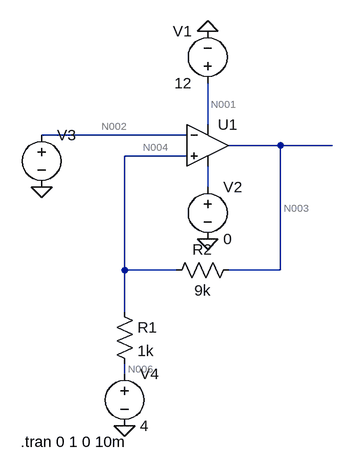
[diagram p0: schematic schmidt trigger.asc]
schmidt trigger.asc, the LTspice schematic file:
Version 4.1
SHEET 1 880 712
WIRE 240 208 240 144
WIRE 208 224 -16 224
WIRE 352 240 272 240
WIRE 432 240 352 240
WIRE 208 256 112 256
WIRE 240 304 240 272
WIRE 112 432 112 256
WIRE 192 432 112 432
WIRE 352 432 352 240
WIRE 352 432 272 432
WIRE 112 496 112 432
WIRE 112 592 112 576
FLAG 240 384 0
FLAG -16 304 0
FLAG 240 64 0
FLAG 112 672 0
SYMBOL OpAmps\\UniversalOpAmp2 240 240 R0
SYMATTR InstName U1
SYMBOL voltage 240 160 R180
WINDOW 0 24 96 Left 2
WINDOW 3 24 16 Left 2
WINDOW 123 0 0 Left 0
WINDOW 39 0 0 Left 0
SYMATTR InstName V1
SYMATTR Value 12
SYMBOL voltage -16 208 R0
WINDOW 3 24 96 Invisible 2
WINDOW 123 0 0 Left 0
WINDOW 39 0 0 Left 0
SYMATTR Value SINE(3.5 1.5 10)
SYMATTR InstName V3
SYMBOL voltage 240 288 R0
WINDOW 123 0 0 Left 0
WINDOW 39 0 0 Left 0
SYMATTR InstName V2
SYMATTR Value 0
SYMBOL res 288 416 R90
WINDOW 0 0 56 VBottom 2
WINDOW 3 32 56 VTop 2
SYMATTR InstName R2
SYMATTR Value 9k
SYMBOL res 96 480 R0
SYMATTR InstName R1
SYMATTR Value 1k
SYMBOL voltage 112 576 R0
WINDOW 123 0 0 Left 0
WINDOW 39 0 0 Left 0
SYMATTR InstName V4
SYMATTR Value 4
TEXT -48 696 Left 2 !.tran 0 1 0 10m

The netlist it stands for:
* schmidt trigger.asc
X§U1 N004 N002 N001 N005 N003 level2 Avol=1Meg GBW=10Meg Slew=10Meg Ilimit=25m Rail=0 Vos=0 En=0 Enk=0 In=0 Ink=0 Rin=500Meg  ; pins In+ In- V+ V- OUT
V1 N001 0 12
V3 N002 0 SINE(3.5 1.5 10)
V2 N005 0 0
R2 N003 N004 9k
R1 N004 N006 1k
V4 N006 0 4
.tran 0 1 0 10m
.lib UniversalOpAmp2.lib
.backanno
.end

* Results of the author's LTspice run, read from the files saved beside the schematic
* Operating Point, zero values left out:
*   V(n001) = 12 V
*   V(n002) = 3.5 V
*   V(n003) = 11.99 V
*   V(n004) = 4.799 V
*   V(n006) = 4 V
*   I(R1) = 799.2 µA
*   I(R2) = 799.2 µA
*   I(V1) = -800.4 µA
*   I(V2) = 1.373 µA
*   I(V3) = 5 nA
*   I(V4) = 799.2 µA
*   Ix(u1:1) = -2.402 nA
*   Ix(u1:2) = -5 nA
*   Ix(u1:3) = 800.4 µA
*   Ix(u1:4) = -1.373 µA
*   Ix(u1:5) = -799.2 µA
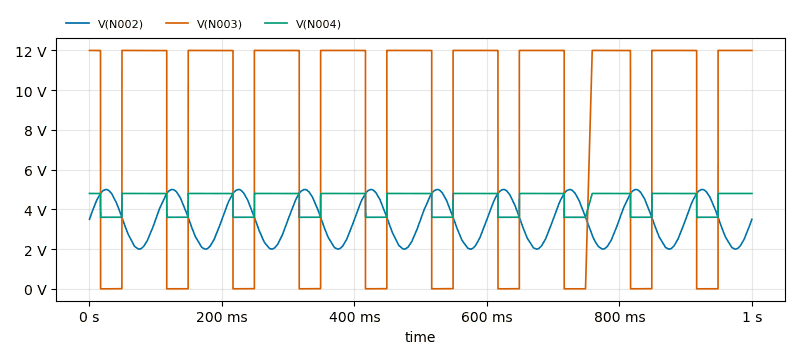
[diagram p1: Transient Analysis of schmidt trigger.asc, plotted from the saved traces]
* Transient Analysis, 1 run:
*   V(N002): min 2 V, max 5 V, average 3.502 V, rms 3.662 V, last 3.5 V
*   V(N003): min 4.104 mV, max 12 V, average 8.064 V, rms 9.833 V, last 11.99 V
*   V(N004): min 3.6 V, max 4.8 V, average 4.406 V, rms 4.442 V, last 4.799 V